# EAGLE schematic wildcatmfd_pcb_schematic (EAGLE 9.6.2)
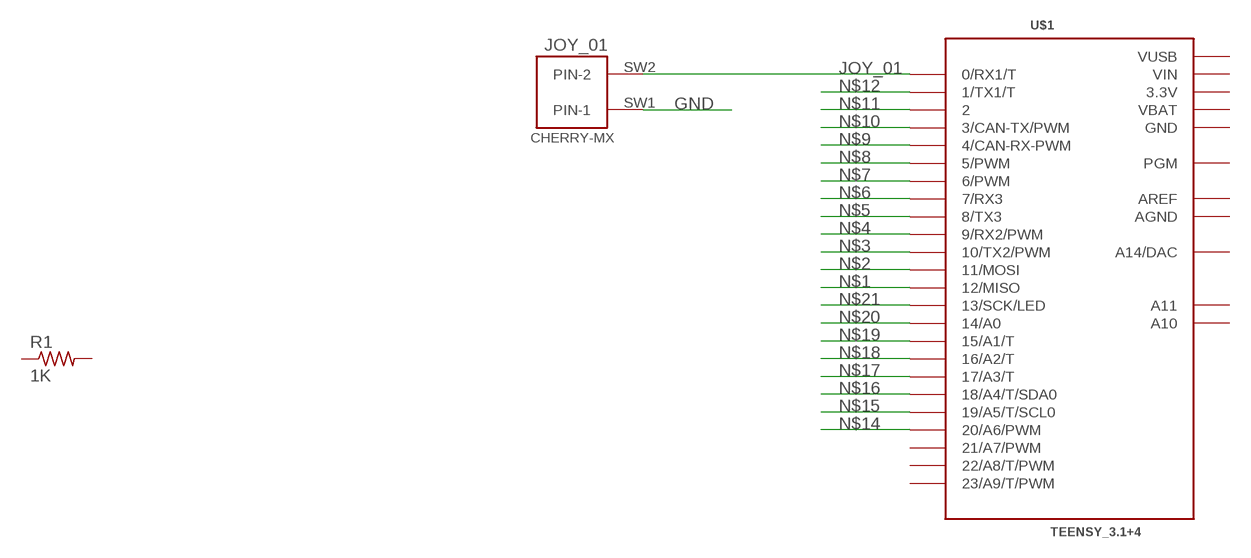
[diagram p0: schematic, sheet 1]

## Parts
JOY_01  CHERRY-MX  [CHERRY-MX]
R1  1K  R-US_R0805  [R0805]
U$1  TEENSY_3.1+4  [TEENSY_3.1+4]

## Nets
GND: JOY_01.SW1(PIN-1)
JOY_01: JOY_01.SW2(PIN-2) U$1.0(0/RX1/T)
N$1: U$1.12(12/MISO)
N$2: U$1.11(11/MOSI)
N$3: U$1.10(10/TX2/PWM)
N$4: U$1.9(9/RX2/PWM)
N$5: U$1.8(8/TX3)
N$6: U$1.7(7/RX3)
N$7: U$1.6(6/PWM)
N$8: U$1.5(5/PWM)
N$9: U$1.4(4/CAN-RX-PWM)
N$10: U$1.3(3/CAN-TX/PWM)
N$11: U$1.2
N$12: U$1.1(1/TX1/T)
N$14: U$1.20/A6(20/A6/PWM)
N$15: U$1.19/A5(19/A5/T/SCL0)
N$16: U$1.18/A4(18/A4/T/SDA0)
N$17: U$1.17/A3(17/A3/T)
N$18: U$1.16/A2(16/A2/T)
N$19: U$1.15/A1(15/A1/T)
N$20: U$1.14/A0
N$21: U$1.13(13/SCK/LED)
Unconnected: R1.1 R1.2 U$1.21/A7(21/A7/PWM) U$1.22/A8(22/A8/T/PWM) U$1.23/A9(23/A9/T/PWM) U$1.A10 U$1.A11 U$1.A14(A14/DAC) U$1.PGM

## Power pins joined to a net without a drawn wire
3.3V: U$1.3.3V U$1.3.3V1(3.3V)
AGND: U$1.AGND
AREF: U$1.AREF
GND: U$1.GND U$1.GND1(GND)
VBAT: U$1.VBAT
VIN: U$1.VIN
VUSB: U$1.VUSB

## Library data of the parts
JOY_01 = cherrymx:CHERRY-MX: Cherry MX series keyswitch
R1 = rcl:R-US_: RESISTOR, American symbol; SPICEPREFIX: R
U$1 = Teensy_3_Series_Board_v1.0:TEENSY_3.1+4: Footprint for Teensy 3.1 board using all through-holes, i.e. the entire perimeter plus the 4 through-holes inboard (A10,A11,AREF, VUSB)